# Altium schematic sheet PAGE4 - SFP.SchDoc
size A3; DocumentNumber: 4; SheetNumber: 4; SheetTotal: 4
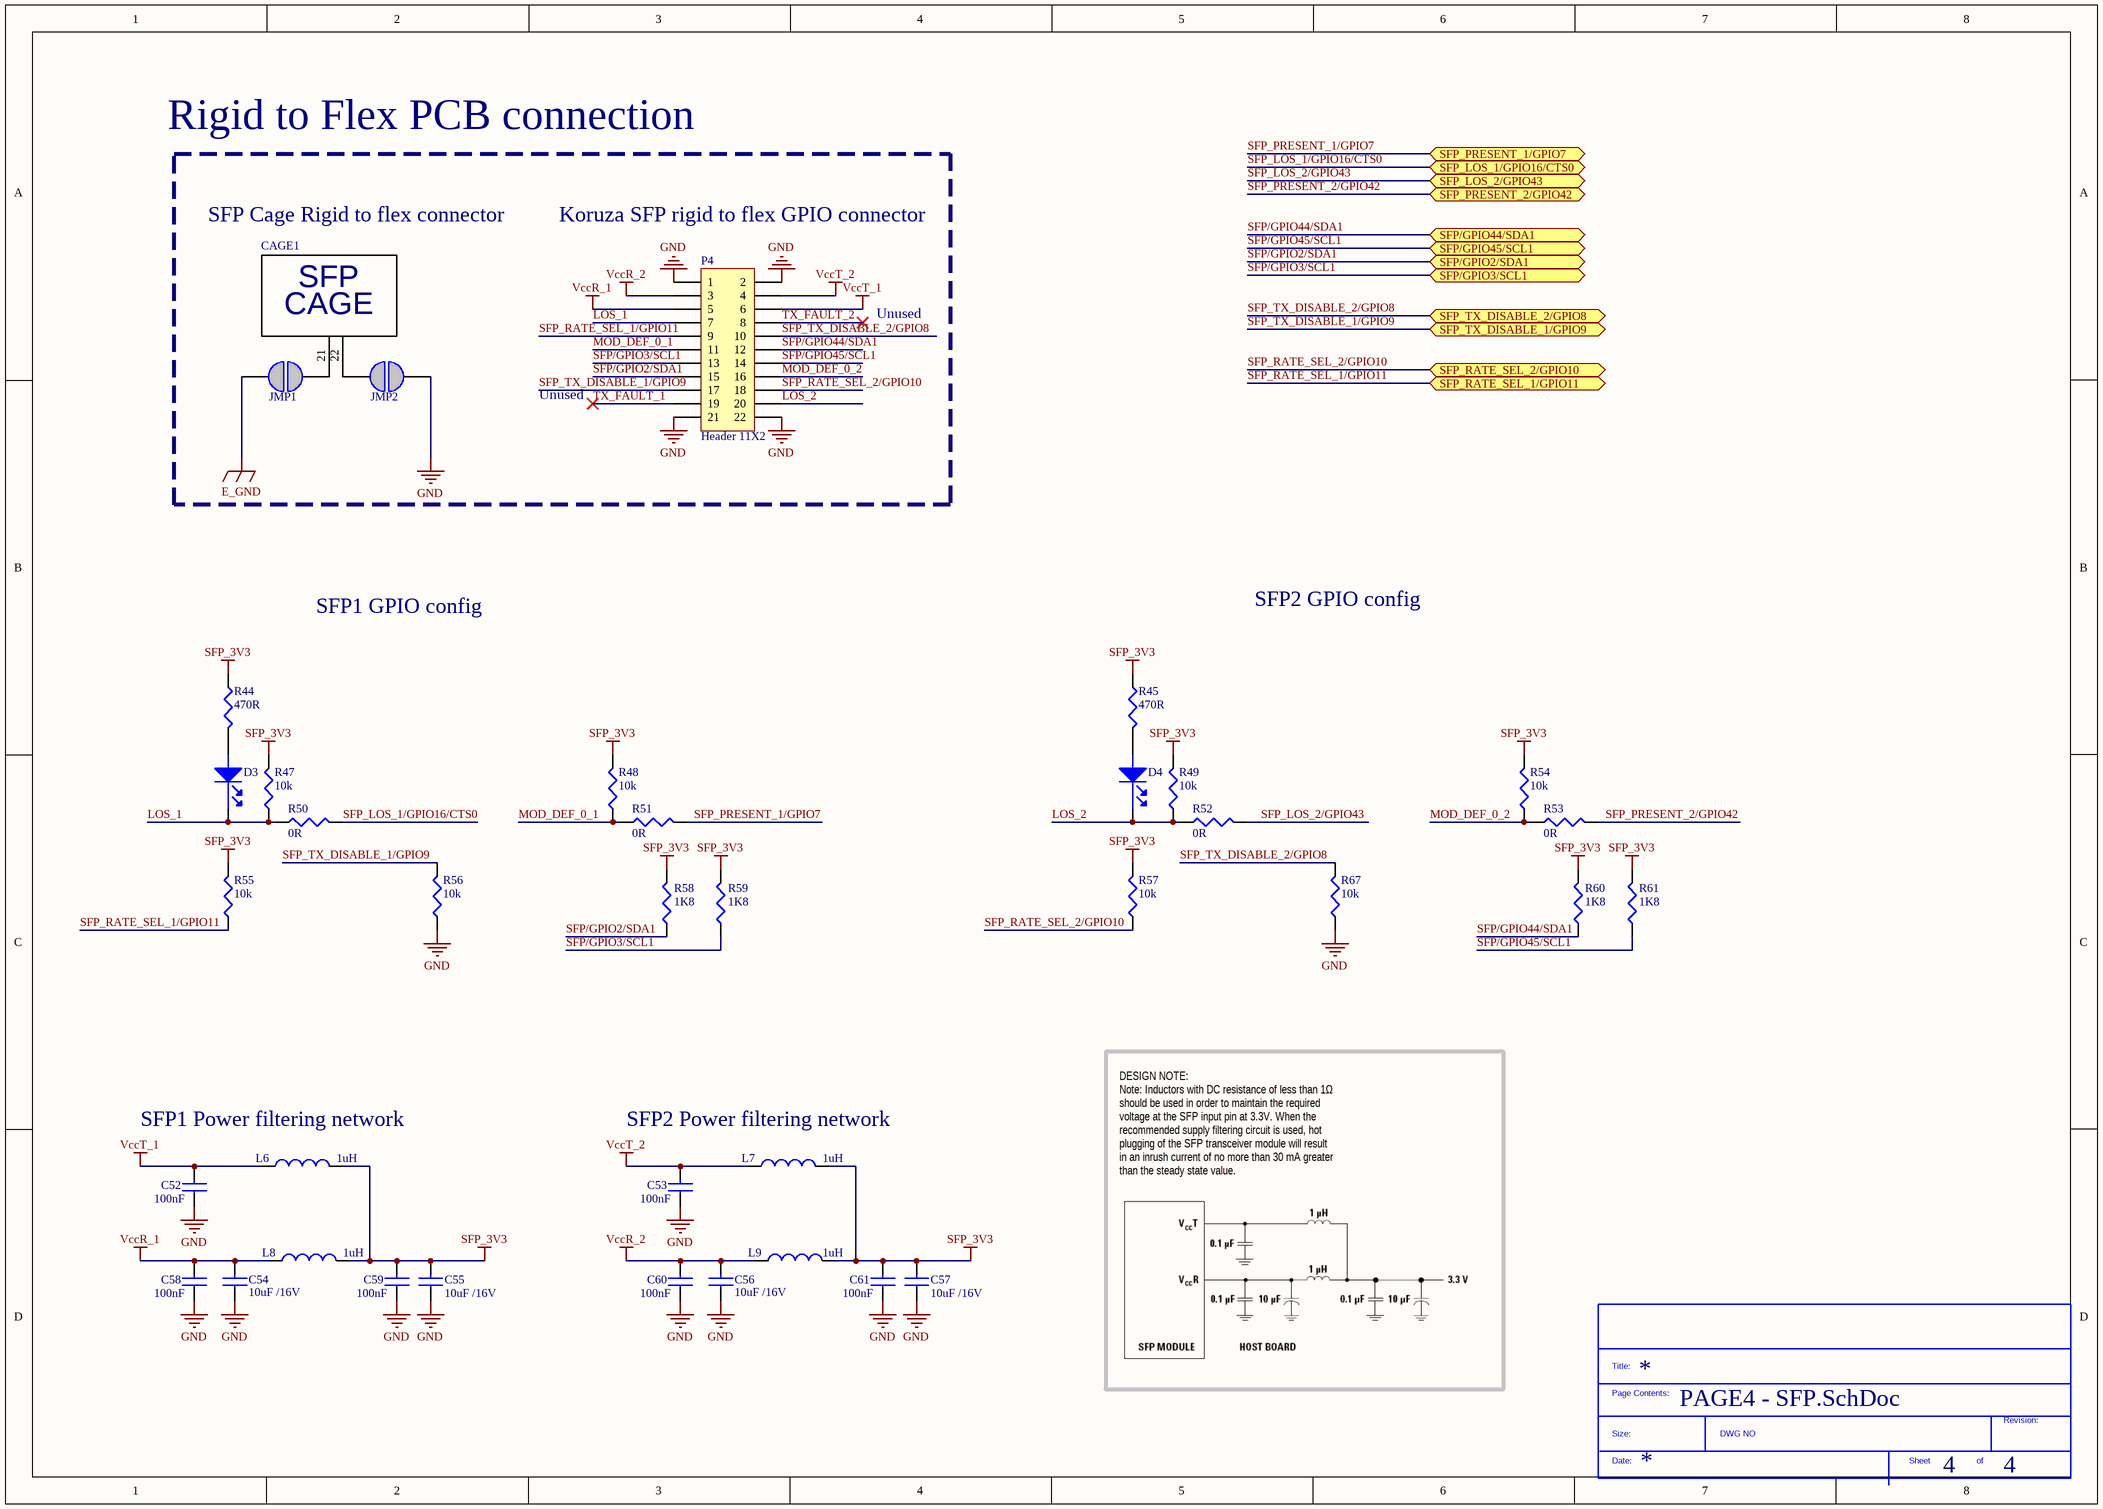
[diagram p0: PAGE4 - SFP.SchDoc]

## Parts
*?  SDTitleBlock  (value not drawn)  (graphical)
C52  100nF  [CAP0603]
C53  100nF  [CAP0603]
C54  10uF /16V  [CAP0603]
C55  10uF /16V  [CAP0603]
C56  10uF /16V  [CAP0603]
C57  10uF /16V  [CAP0603]
C58  100nF  [CAP0603]
C59  100nF  [CAP0603]
C60  100nF  [CAP0603]
C61  100nF  [CAP0603]
CAGE1  SFP_CAGE  [PCB_SFP_CAGE_FOOTPRINT]  (value not drawn)
D3  LED RED  [LED0603]  (value not drawn)
D4  LED RED  [LED0603]  (value not drawn)
JMP1  smd solder JMP  [RES0603]  (value not drawn)  (no BOM)
JMP2  smd solder JMP  [RES0603]  (value not drawn)  (no BOM)
L6  1uH  [CAP0805]
L7  1uH  [CAP0805]
L8  1uH  [CAP0805]
L9  1uH  [CAP0805]
P4  Header 11X2  [HDR2X11]  (no BOM)
R44  470R  [RES0603]
R45  470R  [RES0603]
R47  10k  [RES0603]
R48  10k  [RES0603]
R49  10k  [RES0603]
R50  0R  [RES0603]
R51  0R  [RES0603]
R52  0R  [RES0603]
R53  0R  [RES0603]
R54  10k  [RES0603]
R55  10k  [RES0603]
R56  10k  [RES0603]
R57  10k  [RES0603]
R58  1K8  [RES0603]
R59  1K8  [RES0603]
R60  1K8  [RES0603]
R61  1K8  [RES0603]
R67  10k  [RES0603]

## Ports
SFP/GPIO2/SDA1 (bidir), SFP/GPIO3/SCL1 (bidir), SFP/GPIO44/SDA1 (bidir), SFP/GPIO45/SCL1 (bidir), SFP_LOS_1/GPIO16/CTS0 (bidir), SFP_LOS_2/GPIO43 (bidir), SFP_PRESENT_1/GPIO7 (bidir), SFP_PRESENT_2/GPIO42 (bidir), SFP_RATE_SEL_1/GPIO11 (bidir), SFP_RATE_SEL_2/GPIO10 (bidir), SFP_TX_DISABLE_1/GPIO9 (bidir), SFP_TX_DISABLE_2/GPIO8 (bidir)

## Nets
E_GND: JMP1.2
GND: C52.1 C53.1 C54.1 C55.1 C56.1 C57.1 C58.1 C59.1 C60.1 C61.1 JMP2.1 P4.1 P4.2 P4.21 P4.22 R56.1 R67.1
SFP_3V3: C55.2 C57.2 C59.2 C61.2 L6.2 L7.2 L8.2 L9.2 R44.1 R45.1 R47.2 R48.2 R49.2 R54.2 R55.2 R57.2 R58.2 R59.2 R60.2 R61.2
VccR_1: C54.2 C58.2 L8.1 P4.5
VccR_2: C56.2 C60.2 L9.1 P4.3
VccT_1: C52.2 L6.1 P4.6
VccT_2: C53.2 L7.1 P4.4
LOS_1: D3.1(cathode) P4.7 R47.1 R50.1
LOS_2: D4.1(cathode) P4.20 R49.1 R52.1
MOD_DEF_0_1: P4.11 R48.1 R51.1
MOD_DEF_0_2: P4.16 R53.1 R54.1
SFP/GPIO2/SDA1: P4.15 R58.1 ; port SFP/GPIO2/SDA1
SFP/GPIO3/SCL1: P4.13 R59.1 ; port SFP/GPIO3/SCL1
SFP/GPIO44/SDA1: P4.12 R60.1 ; port SFP/GPIO44/SDA1
SFP/GPIO45/SCL1: P4.14 R61.1 ; port SFP/GPIO45/SCL1
SFP_LOS_1/GPIO16/CTS0: R50.2 ; port SFP_LOS_1/GPIO16/CTS0
SFP_LOS_2/GPIO43: R52.2 ; port SFP_LOS_2/GPIO43
SFP_PRESENT_1/GPIO7: R51.2 ; port SFP_PRESENT_1/GPIO7
SFP_PRESENT_2/GPIO42: R53.2 ; port SFP_PRESENT_2/GPIO42
SFP_RATE_SEL_1/GPIO11: P4.9 R55.1 ; port SFP_RATE_SEL_1/GPIO11
SFP_RATE_SEL_2/GPIO10: P4.18 R57.1 ; port SFP_RATE_SEL_2/GPIO10
SFP_TX_DISABLE_1/GPIO9: P4.17 R56.2 ; port SFP_TX_DISABLE_1/GPIO9
SFP_TX_DISABLE_2/GPIO8: P4.10 R67.2 ; port SFP_TX_DISABLE_2/GPIO8
TX_FAULT_1: P4.19
TX_FAULT_2: P4.8
NetCAGE1_21: CAGE1.21 JMP1.1
NetCAGE1_22: CAGE1.22 JMP2.2
NetD3_2: D3.2(ANODE) R44.2
NetD4_2: D4.2(ANODE) R45.2

## Notes on the sheet
- Rigid to Flex PCB connection
- SFP Cage Rigid to flex connector
- Koruza SFP rigid to flex GPIO connector
- Unused
- SFP1 GPIO config
- SFP2 GPIO config
- SFP1 Power filtering network
- SFP2 Power filtering network
- DESIGN NOTE:
  Note: Inductors with DC resistance of less than 1Ω
  should be used in order to maintain the required
  voltage at the SFP input pin at 3.3V. When the
  recommended supply filtering circuit is used, hot
  plugging of the SFP transceiver module will result
  in an inrush current of no more than 30 mA greater
  than the steady state value.
- (in symbol SDTitleBlock) Title:; Page Contents:; Revision:; Size:; DWG NO; Date:; Sheet; of
- (in symbol SFP_CAGE_FOOTPRINT) CAGE

## Library data of the parts
C52 C53 C58-C61 = 100nF: MURATA - GRM188R71C104KA01J - CAP, MLCC, X7R, 0.1UF, 16V, 0603; Ceramic Capacitor Case: 0603 [1608 Metric]; Capacitance: 0.1; Voltage Rating: 16; Capacitance Tolerance: ± 10%; Dielectric Characteristic: X7; Product Range: GRM Series; SVHC: No SVHC (20-Jun-2016; Supplier 1: Farnell; Manufacturer: MURATA; Manufacturer Part Number: GRM188R71C104KA01J; RoHS: YES; Stock 1: 18297; Pricing 1: 10=0.0145, 100=0.0126, 500=0.0081, 2500=0.0059, 5000=0.0052, 10000=0.0046, 50000=0.0036, 100000=0.0035 (GBP); Packaging: Cut Tape; Operating Temperature Min: -55; Operating Temperature Max: 125; Automotive Qualification Standard: -; MSL: MSL 1 - Unlimited; ComponentLink1URL: http://www.farnell.com/datasheets/2189124.pdf; ComponentLink1Description: http://www.farnell.com/datasheets/2189124.pdf; Supplier Part Number 1: 2688519
C54-C57 = GRM188R61C106MA73D: MURATA - GRM188R61C106MA73D - CAP, MLCC, X5R, 10UF, 16V, 0603; Ceramic Capacitor Case: 0603 [1608 Metric]; Capacitance: 10; Voltage Rating: 16; Capacitance Tolerance: ± 20%; Dielectric Characteristic: X5; Product Range: GRM Series; SVHC: No SVHC (17-Dec-2015)<!--FANDB--><div class="features-and-benefits-container"><div class="features-and-benefits-description"><span class="features-benefits-value">The Murata GRM series capacitors are Multilayer Ceramic Chip Capacitors (MLCC) used for general purpose applications. These MLCC capacitors are classified into temperature compensating and high dielectric constant types depending on the change in electrostatic capacitance due to change in temperature. The temperature compensating capacitors feature a small rate of change in electrostatic capacitance as the temperature changes and are used for applications such as filters and high frequency circuit matching. The high dielectric constant capacitors use materials with a high dielectric constant and feature a large electrostatic capacitance. Typical applications are power supply decoupling and smoothing circuits.</span></div><div class="features-and-benefits-list"><ul class="features-and-benefits-list-list"><li class="features-and-benefits-list-item">Large capacity and small size in a multilayer structure</li><li class="features-and-benefits-list-item">Capacitance value ranging from 0.1pF to 220?F</li><li class="features-and-benefits-list-item">Tin plated external electrodes, excellent solderability</li><li class="features-and-benefits-list-item">Provides good high frequency characteristics</li><li class="features-and-benefits-list-item">Excellent pulse response</li><li class="features-and-benefits-list-item">High reliability</li><li class="features-and-benefits-list-item">Capacitor size varies from 0.4×0.2mm to 5.7×5.0mm</li><li class="features-and-benefits-list-item">Rated voltage of 2.5VDC to 3.15; Supplier 1: Farnell; Manufacturer: MURATA; Manufacturer Part Number: GRM188R61C106MA73D; RoHS: YES; Stock 1: 21735; Pricing 1: 10=0.181, 100=0.103, 500=0.0863, 1000=0.0778, 2000=0.0677 (GBP); Packaging: Cut Tape; Operating Temperature Min: -55; Operating Temperature Max: 85; Automotive Qualification Standard: -; MSL: -; ComponentLink1URL: http://www.farnell.com/datasheets/2048226.pdf; ComponentLink1Description: http://www.farnell.com/datasheets/2048226.pdf; Supplier Part Number 1: 2426958
CAGE1 = SFP_CAGE_FOOTPRINT: TE CONNECTIVITY - 2007194-1 - CAGE, 1X1, SFP+, PCI APPLICATIONS; Accessory Type: Connector Cage / Frame; For Use With: Small Form-Factor Pluggable Connectors; Connector Mounting: PCB Mount; Connector Mounting Orientation: PC Board; Connector Type: SFP; Contact Termination: Solder; Configuration: Discrete; Number of LEDs: 10; Utilized LED: SK6812 or WS2812; Interface: Serial (Shift Register); Supplier 1: Farnell; Manufacturer: TE CONNECTIVITY; Manufacturer Part Number: 2007194-1; RoHS: YES; Stock 1: 26; Pricing 1: 1=4.6, 5=4.41, 10=4.22, 25=4.03, 50=3.5, 200=3.18, 500=2.86, 2000=2.8 (GBP); Product Range: -; Material: Nickel Silver<!--FANDB--><div class="features-and-benefits-container"><div class="features-and-benefits-description"><span class="features-benefits-value">The 2007194-1 is a 1-port Cage Assembly with external springs and solder through-hole termination. It is made with nickel silver single cage. The SFP+ pluggable cage designed to support data rate of 16Gbps. This SFP+ pluggable cage has one degree mounting angle to meet the requirements of SFF-8075 for PCI card applications and support belly-to-belly mount applications.</span></div><div class="features-and-benefits-applications"><ul class="features-and-benefits-value"><li class="features-and-benefits-list-item">Industrial</li></ul></div></div>; ComponentLink1URL: http://www.farnell.com/datasheets/1654545.pdf; ComponentLink1Description: http://www.farnell.com/datasheets/1654545.pdf; ComponentLink2URL: http://www.farnell.com/cad/1661409.pdf; ComponentLink2Description: http://www.farnell.com/cad/1661409.pdf; ComponentLink3URL: http://www.farnell.com/datasheets/1922296.pdf; ComponentLink3Description: http://www.farnell.com/datasheets/1922296.pdf; Supplier Part Number 1: 1755779; Supplier 2: Digi-Key; Category: Optoelectronics; Stock 2: 7416; Pricing 2: 1=4.5, 10=4.05 (USD); Part Status: Active; Color: Red, Green, Blue (RGB); Controller Type: -; Mounting Type: Surface Mount; Size / Dimension: 5.00mm L x 5.00mm W; ComponentLink4URL: https://cdn-shop.adafruit.com/product-files/1138/SK6812+LED+datasheet+.pdf; ComponentLink4Description: https://cdn-shop.adafruit.com/product-files/1138/SK6812+LED+datasheet+.pdf; Supplier Part Number 2: 1528-1104-ND
D3 D4 = HSMS-C190: BROADCOM LIMITED - HSMS-C190 - LED, RED, 10MCD, 626NM; LED Mounting: SMD; Forward Current If: 20; Forward Voltage: 2.1; Wavelength Typ: 626; Luminous Intensity: 10; Viewing Angle: 170°; Lens Shape: Rectangular; SVHC: No SVHC (17-Dec-2015)<!--FANDB--><div class="features-and-benefits-container"><div class="features-and-benefits-description"><span class="features-benefits-value">The HSMS-C190 is a HER SMD Chip LED with untinted/diffused lens, made of GaP. It is designed in an industry standard package 1.6 x 0.8mm footprint with 0.8mm profile. It is compatible with IR reflow solder processes. The small size and wide viewing angle make this LED prime choices for backlighting applications and front panel illumination especially where space is a premium.</span></div><div class="features-and-benefits-list"><ul class="features-and-benefits-list-list"><li class="features-and-benefits-list-item">Small size</li><li class="features-and-benefits-list-item">Industry standard footprint</li><li class="features-and-benefits-list-item">Compatible with IR solder</li><li class="features-and-benefits-list-item">Diffused optics</li><li class="features-and-benefits-list-item">-40 to 85; Supplier 1: Farnell; Manufacturer: BROADCOM LIMITED; Manufacturer Part Number: HSMS-C190; RoHS: YES; Stock 1: 7534; Pricing 1: 1=0.361, 10=0.256, 50=0.235, 100=0.106, 200=0.101 (GBP); LED Colour: Red; Bulb Size: -; Packaging: Cut Tape; Product Range: -; Automotive Qualification Standard: -; MSL: -; ComponentLink1URL: http://www.farnell.com/datasheets/313031.pdf; ComponentLink1Description: http://www.farnell.com/datasheets/313031.pdf; ComponentLink2URL: http://www.farnell.com/datasheets/1681524.pdf; ComponentLink2Description: http://www.farnell.com/datasheets/1681524.pdf; ComponentLink3URL: http://www.farnell.com/datasheets/2165483.pdf; ComponentLink3Description: http://www.farnell.com/datasheets/2165483.pdf; Supplier Part Number 1: 2497356
L6-L9 = 74479773210: WURTH ELEKTRONIK - 74479773210 - INDUCTOR, MULTILAYER, 1UH, SMD; Product Range: WE-PMI Series; Inductance: 1; DC Resistance Max: 0.18; Inductance Tolerance: ± 20%; Power Inductor Case: 2mm x 1.25mm x 0.5; RMS Current (Irms): 1.2; Saturation Current (Isat): 800; Supplier 1: Farnell; Manufacturer: WURTH ELEKTRONIK; Manufacturer Part Number: 74479773210; RoHS: YES; Stock 1: 46; Pricing 1: 1=0.39, 50=0.34, 100=0.29, 250=0.25 (GBP); Inductor Construction: Multilayer; Packaging: Cut Tape; ComponentLink1URL: http://www.farnell.com/cad/2130715.pdf; ComponentLink1Description: http://www.farnell.com/cad/2130715.pdf; ComponentLink2URL: http://www.farnell.com/datasheets/1795751.pdf; ComponentLink2Description: http://www.farnell.com/datasheets/1795751.pdf; Supplier Part Number 1: 2400015
P4 = Header 11X2: Header, 11-Pin, Dual row; LatestRevisionDate: 17-Jul-2002; LatestRevisionNote: Re-released for DXP Platform.; Publisher: Altium Limited
R44 R45 = MCMR06X471 JTL: MULTICOMP - MCMR06X471 JTL - RES, CERAMIC, 470R, 5%, 0.1W, 0603; Supplier 1: Farnell; Manufacturer: MULTICOMP; Manufacturer Part Number: MCMR06X471 JTL; RoHS: Y-EX; Stock 1: 3786; Pricing 1: 10=0.0089, 100=0.0076, 500=0.0063, 1000=0.0049, 2500=0.0033, 5000=0.0024, 25000=0.0016, 50000=0.0013 (GBP); ComponentLink1URL: http://www.farnell.com/datasheets/1716707.pdf; ComponentLink1Description: http://www.farnell.com/datasheets/1716707.pdf; Supplier Part Number 1: 2073513
R47-R49 R54-R57 R67 = 10k: MULTICOMP - MCMR06X103 JTL - RES, CERAMIC, 10K, 5%, 0.1W, 0603; Resistance: 10; Voltage Rating: 75; Resistor Case Style: 0603 [1608 Metric]; Power Rating: 100; Product Range: MCMR Series; Temperature Coefficient: ± 100; Automotive Qualification Standard: -<!--FANDB--><div class="features-and-benefits-container"><div class="features-and-benefits-description"><span class="features-benefits-value">The Multicomp MCMR series resistors are automotive grade, anti sulphured thick film chip resistor. The resistance range includes E24 and E96 decade values from 1ohm to 10Mohm. These resistors are constructed on top of a high grade ceramic body.</span></div><div class="features-and-benefits-list"><ul class="features-and-benefits-list-list"><li class="features-and-benefits-list-item">EIA 0402, 0603, 0805, 1206 chip sizes available</li><li class="features-and-benefits-list-item">High reliability and stability</li><li class="features-and-benefits-list-item">Automotive grade AEC-Q200 compliant</li><li class="features-and-benefits-list-item">Complaint with (IEC 60068-1) 55/155/56 climatic category</li><li class="features-and-benefits-list-item">Maximum operation voltage of 50V, 75V, 150V and 200V</li><li class="features-and-benefits-list-item">Power rating of 62.5mW, 100mW, 125mW and 250mW</li><li class="features-and-benefits-list-item">Available in ±1% and ±5% tolerance</li><li class="features-and-benefits-list-item">Temperature coefficient (TCR) of +200ppm/°C, +100ppm/°C and -200ppm/°C to +400ppm/°C</li><li class="features-and-benefits-list-item">Operating temperature range -55°C to 155; Supplier 1: Farnell; Manufacturer: MULTICOMP; Manufacturer Part Number: MCMR06X103 JTL; RoHS: Y-EX; Stock 1: 19791; Pricing 1: 10=0.0087, 100=0.0074, 500=0.0061, 1000=0.0048, 2500=0.0032, 5000=0.0024, 25000=0.0016, 50000=0.0013 (GBP); Resistance Tolerance: ± 5%; Packaging: Cut Tape; Resistor Element Material: Ceramic; ComponentLink1URL: http://www.farnell.com/datasheets/1716707.pdf; ComponentLink1Description: http://www.farnell.com/datasheets/1716707.pdf; Supplier Part Number 1: 2073356
R50-R53 = CR0603-J/-000ELF: BOURNS - CR0603-J/-000ELF - RES, THICK FILM, 0R, 5%, 0.1W, 0603; Resistance: 0; Voltage Rating: 50; Resistor Case Style: 0603 [1608 Metric]; Power Rating: 100; Product Range: CR Series; SVHC: No SVHC (17-Dec-2015); Resistor Mounting: Surface Mount Device<!--FANDB--><div class="features-and-benefits-container"><div class="features-and-benefits-description"><span class="features-benefits-value">The Bourns CR series are standard thick film chip resistors. These resistors provide flexibility of performance, space saving and low cost. The Resistance range includes E96 and E24 decade values from 1ohm to 10Mohm.</span></div><div class="features-and-benefits-list"><ul class="features-and-benefits-list-list"><li class="features-and-benefits-list-item">0201, 0402, 0603, 0805, 1206, 1210, 2010, 2512 standard case sizes available</li><li class="features-and-benefits-list-item">±1% and ±5% tolerance</li><li class="features-and-benefits-list-item">±100ppm/°C, ±200ppm/°C and ±250ppm/°C TCR values available</li><li class="features-and-benefits-list-item">Power rating selectable for 50mW, 63mW, 0.1W, 0.125W, 0.25W, 0.5W and 1W based on ordering</li><li class="features-and-benefits-list-item">Jumpers are available for all size</li><li class="features-and-benefits-list-item">3 layer termination process with nickel barrier prevents leaching & provides excellent solderability</li><li class="features-and-benefits-list-item">Suitable for all type of soldering processes</li><li class="features-and-benefits-list-item">Tight dimensional tolerances</li><li class="features-and-benefits-list-item">Maximum working voltage depends on case size</li><li class="features-and-benefits-list-item">Operating temperature of -55°C to +125°C(CR0201) and -55°C to +155; Supplier 1: Farnell; Manufacturer: BOURNS; Manufacturer Part Number: CR0603-J/-000ELF; RoHS: YES; Stock 1: 58200; Pricing 1: 10=0.0146, 250=0.0097, 1000=0.0073, 5000=0.0049, 12500=0.0042 (GBP); Resistance Tolerance: ± 5%; Packaging: Cut Tape; Resistor Element Material: Thick Film; Temperature Coefficient: -; Automotive Qualification Standard: -; MSL: MSL 1 - Unlimited; ComponentLink1URL: http://www.bourns.com/engineering/CHPREZTR/cr0603.stp; ComponentLink1Description: http://www.bourns.com/engineering/CHPREZTR/cr0603.stp; ComponentLink2URL: http://www.farnell.com/datasheets/2178762.pdf; ComponentLink2Description: http://www.farnell.com/datasheets/2178762.pdf; Supplier Part Number 1: 2008343
R58-R61 = CRCW06031K80FKEA: VISHAY - CRCW06031K80FKEA - RES, THICK FILM, 1K8, 1%, 0.1W, 0603; Supplier 1: Farnell; Manufacturer: VISHAY; Manufacturer Part Number: CRCW06031K80FKEA; RoHS: Y-EX; Stock 1: 21649; Pricing 1: 10=0.0105, 100=0.0094, 500=0.0055, 1000=0.005, 2500=0.0038 (GBP); ComponentLink1URL: http://www.farnell.com/datasheets/2111203.pdf; ComponentLink1Description: http://www.farnell.com/datasheets/2111203.pdf; ComponentLink2URL: http://www.farnell.com/cad/1552026.zip; ComponentLink2Description: http://www.farnell.com/cad/1552026.zip; Supplier Part Number 1: 1652854